# Altium schematic sheet I2C Network.SchDoc: I2C Network
size 292 x 193 mm; SheetNumber: 8; SheetTotal: 40
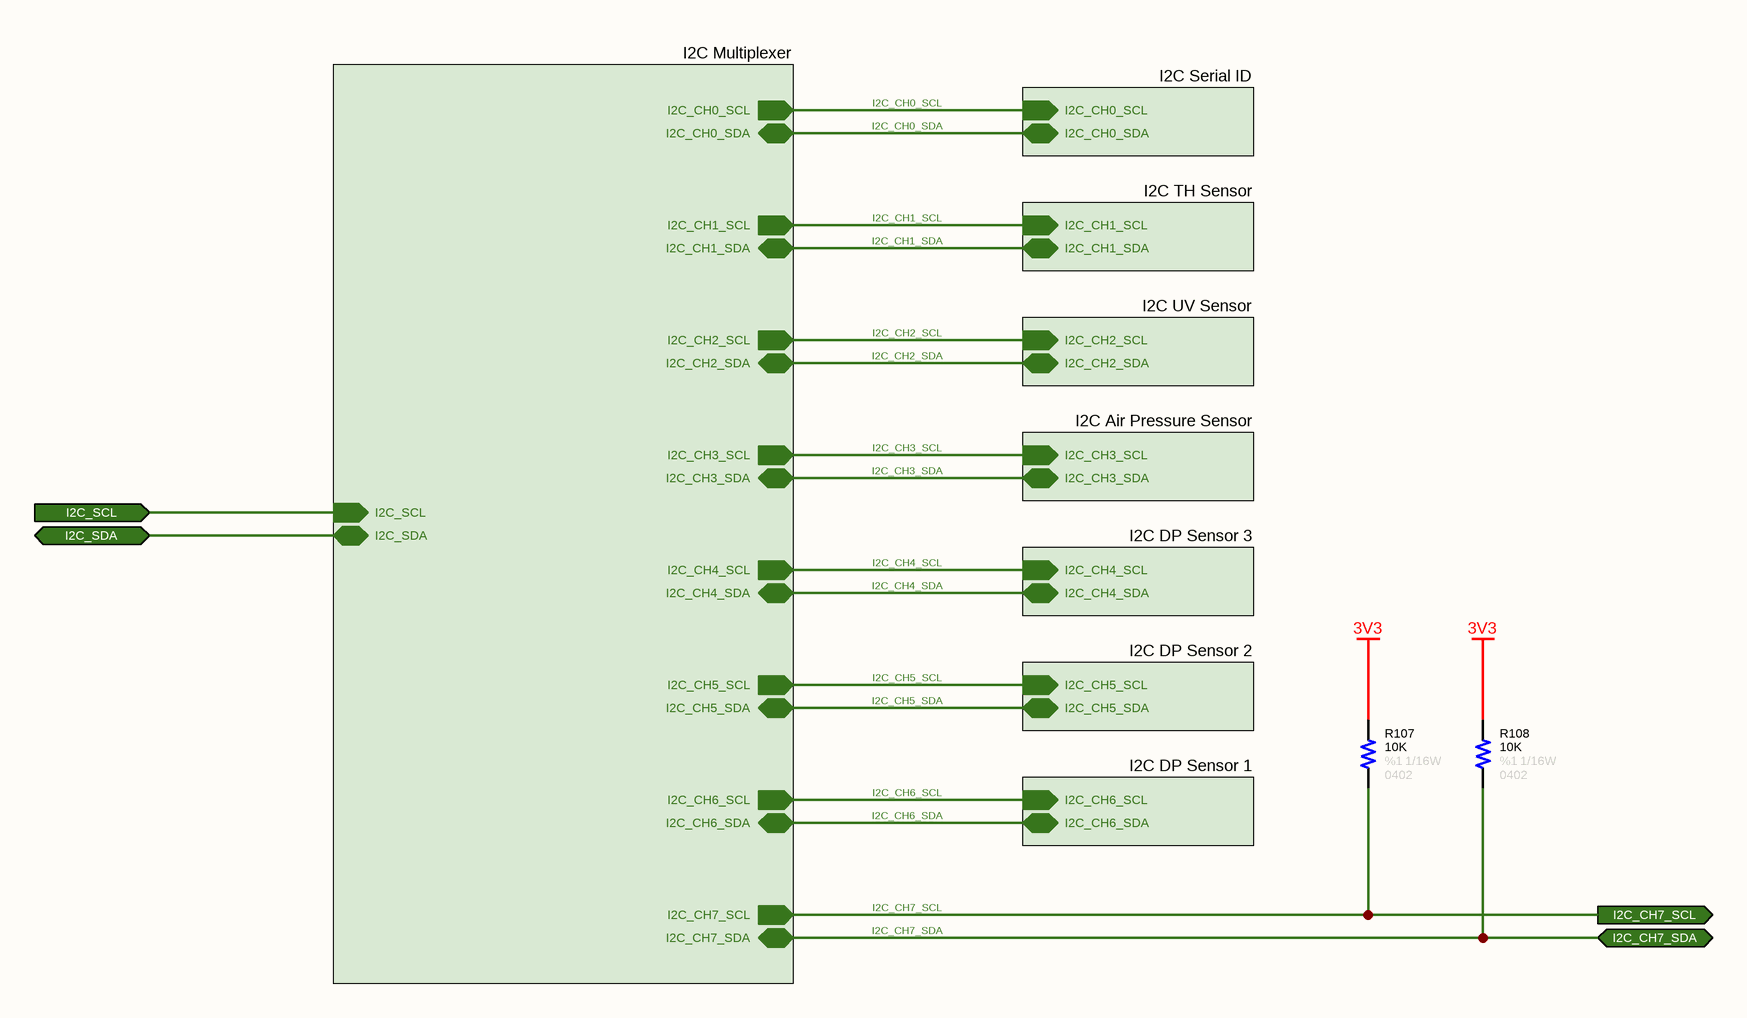
[diagram p0: I2C Network.SchDoc]

## Parts
R107  value 10K  Tolerance: %1  Case: 0402  Power: 1/16W  [RESISTOR_0402]  (hidden comment: 10K - 0402 - %1 - 1/16W)
R108  value 10K  Tolerance: %1  Case: 0402  Power: 1/16W  [RESISTOR_0402]  (hidden comment: 10K - 0402 - %1 - 1/16W)

## Sub-sheets
I2C Air Pressure Sensor = I2C Air Pressure Sensor.SchDoc: I2C_CH3_SCL (in), I2C_CH3_SDA (bidir)
I2C DP Sensor 1 = I2C DP Sensor 1.SchDoc: I2C_CH6_SCL (in), I2C_CH6_SDA (bidir)
I2C DP Sensor 2 = I2C DP Sensor 2.SchDoc: I2C_CH5_SCL (in), I2C_CH5_SDA (bidir)
I2C DP Sensor 3 = I2C DP Sensor 3.SchDoc: I2C_CH4_SCL (in), I2C_CH4_SDA (bidir)
I2C Multiplexer = I2C Multiplexer.SchDoc: I2C_CH1_SCL (out), I2C_CH0_SDA (bidir), I2C_CH1_SDA (bidir), I2C_CH0_SCL (out), I2C_CH3_SCL (out), I2C_CH4_SCL (out), I2C_CH6_SDA (bidir), I2C_CH2_SDA (bidir), I2C_SDA (bidir), I2C_CH6_SCL (out), I2C_CH5_SCL (out), I2C_CH5_SDA (bidir), I2C_CH4_SDA (bidir), I2C_CH2_SCL (out), I2C_CH3_SDA (bidir), I2C_SCL (in), I2C_CH7_SDA (bidir), I2C_CH7_SCL (out)
I2C Serial ID = I2C Serial ID.SchDoc: I2C_CH0_SCL (in), I2C_CH0_SDA (bidir)
I2C TH Sensor = I2C TH Sensor Socket.SchDoc: I2C_CH1_SCL (in), I2C_CH1_SDA (bidir)
I2C UV Sensor = I2C UV Sensor.SchDoc: I2C_CH2_SCL (in), I2C_CH2_SDA (bidir)

## Ports
I2C_CH7_SCL (out), I2C_CH7_SDA (bidir), I2C_SCL (in), I2C_SDA (bidir)

## Nets
3V3: R107.2 R108.2
I2C_CH0_SCL: sheet I2C Multiplexer/I2C_CH0_SCL, sheet I2C Serial ID/I2C_CH0_SCL
I2C_CH0_SDA: sheet I2C Multiplexer/I2C_CH0_SDA, sheet I2C Serial ID/I2C_CH0_SDA
I2C_CH1_SCL: sheet I2C Multiplexer/I2C_CH1_SCL, sheet I2C TH Sensor/I2C_CH1_SCL
I2C_CH1_SDA: sheet I2C Multiplexer/I2C_CH1_SDA, sheet I2C TH Sensor/I2C_CH1_SDA
I2C_CH2_SCL: sheet I2C Multiplexer/I2C_CH2_SCL, sheet I2C UV Sensor/I2C_CH2_SCL
I2C_CH2_SDA: sheet I2C Multiplexer/I2C_CH2_SDA, sheet I2C UV Sensor/I2C_CH2_SDA
I2C_CH3_SCL: sheet I2C Multiplexer/I2C_CH3_SCL, sheet I2C Air Pressure Sensor/I2C_CH3_SCL
I2C_CH3_SDA: sheet I2C Multiplexer/I2C_CH3_SDA, sheet I2C Air Pressure Sensor/I2C_CH3_SDA
I2C_CH4_SCL: sheet I2C Multiplexer/I2C_CH4_SCL, sheet I2C DP Sensor 3/I2C_CH4_SCL
I2C_CH4_SDA: sheet I2C Multiplexer/I2C_CH4_SDA, sheet I2C DP Sensor 3/I2C_CH4_SDA
I2C_CH5_SCL: sheet I2C Multiplexer/I2C_CH5_SCL, sheet I2C DP Sensor 2/I2C_CH5_SCL
I2C_CH5_SDA: sheet I2C Multiplexer/I2C_CH5_SDA, sheet I2C DP Sensor 2/I2C_CH5_SDA
I2C_CH6_SCL: sheet I2C Multiplexer/I2C_CH6_SCL, sheet I2C DP Sensor 1/I2C_CH6_SCL
I2C_CH6_SDA: sheet I2C Multiplexer/I2C_CH6_SDA, sheet I2C DP Sensor 1/I2C_CH6_SDA
I2C_CH7_SCL: R107.1 ; port I2C_CH7_SCL, sheet I2C Multiplexer/I2C_CH7_SCL
I2C_CH7_SDA: R108.1 ; port I2C_CH7_SDA, sheet I2C Multiplexer/I2C_CH7_SDA
I2C_SCL: port I2C_SCL, sheet I2C Multiplexer/I2C_SCL
I2C_SDA: port I2C_SDA, sheet I2C Multiplexer/I2C_SDA

## Notes on the sheet
- © 2021 All rights reserved.
  This document may not, in whole or in part, be copied, photocopied, reproduced, translated or converted to any electronic or machine readable from without prior written permission of Mehmet Günce Akkoyun.
  Engineer contact : akkoyun@me.com
- Property of
- Engineer :
- Date :
- Size :
- A4
- Time :
- Project :
- Page :
- /
- Customer :
- Product ID :
- Module ID :
- Version :
- File :
- Revision :

## Library data of the parts
R107 R108 = Resistor - 10K [0402]: Thick Film Resistors - SMD 1/16 W 10 KOhm 1%; Manufacturer Name: Vishay; Manufacturer Part Number: CRCW040210K0FKED; ComponentLink1Description: DataSheet; ComponentLink1URL: https://www.mouser.com.tr/datasheet/2/427/dcrcwe3-1762152.pdf; ComponentLink2Description: Mouser; ComponentLink2URL: https://www.mouser.com.tr/ProductDetail/Vishay-Dale/CRCW040210K0FKED?qs=sGAEpiMZZMu61qfTUdNhG2DpbjADlD3GcalbOv9utCY%3D